# EAGLE design Painting (EAGLE 9.6.2)
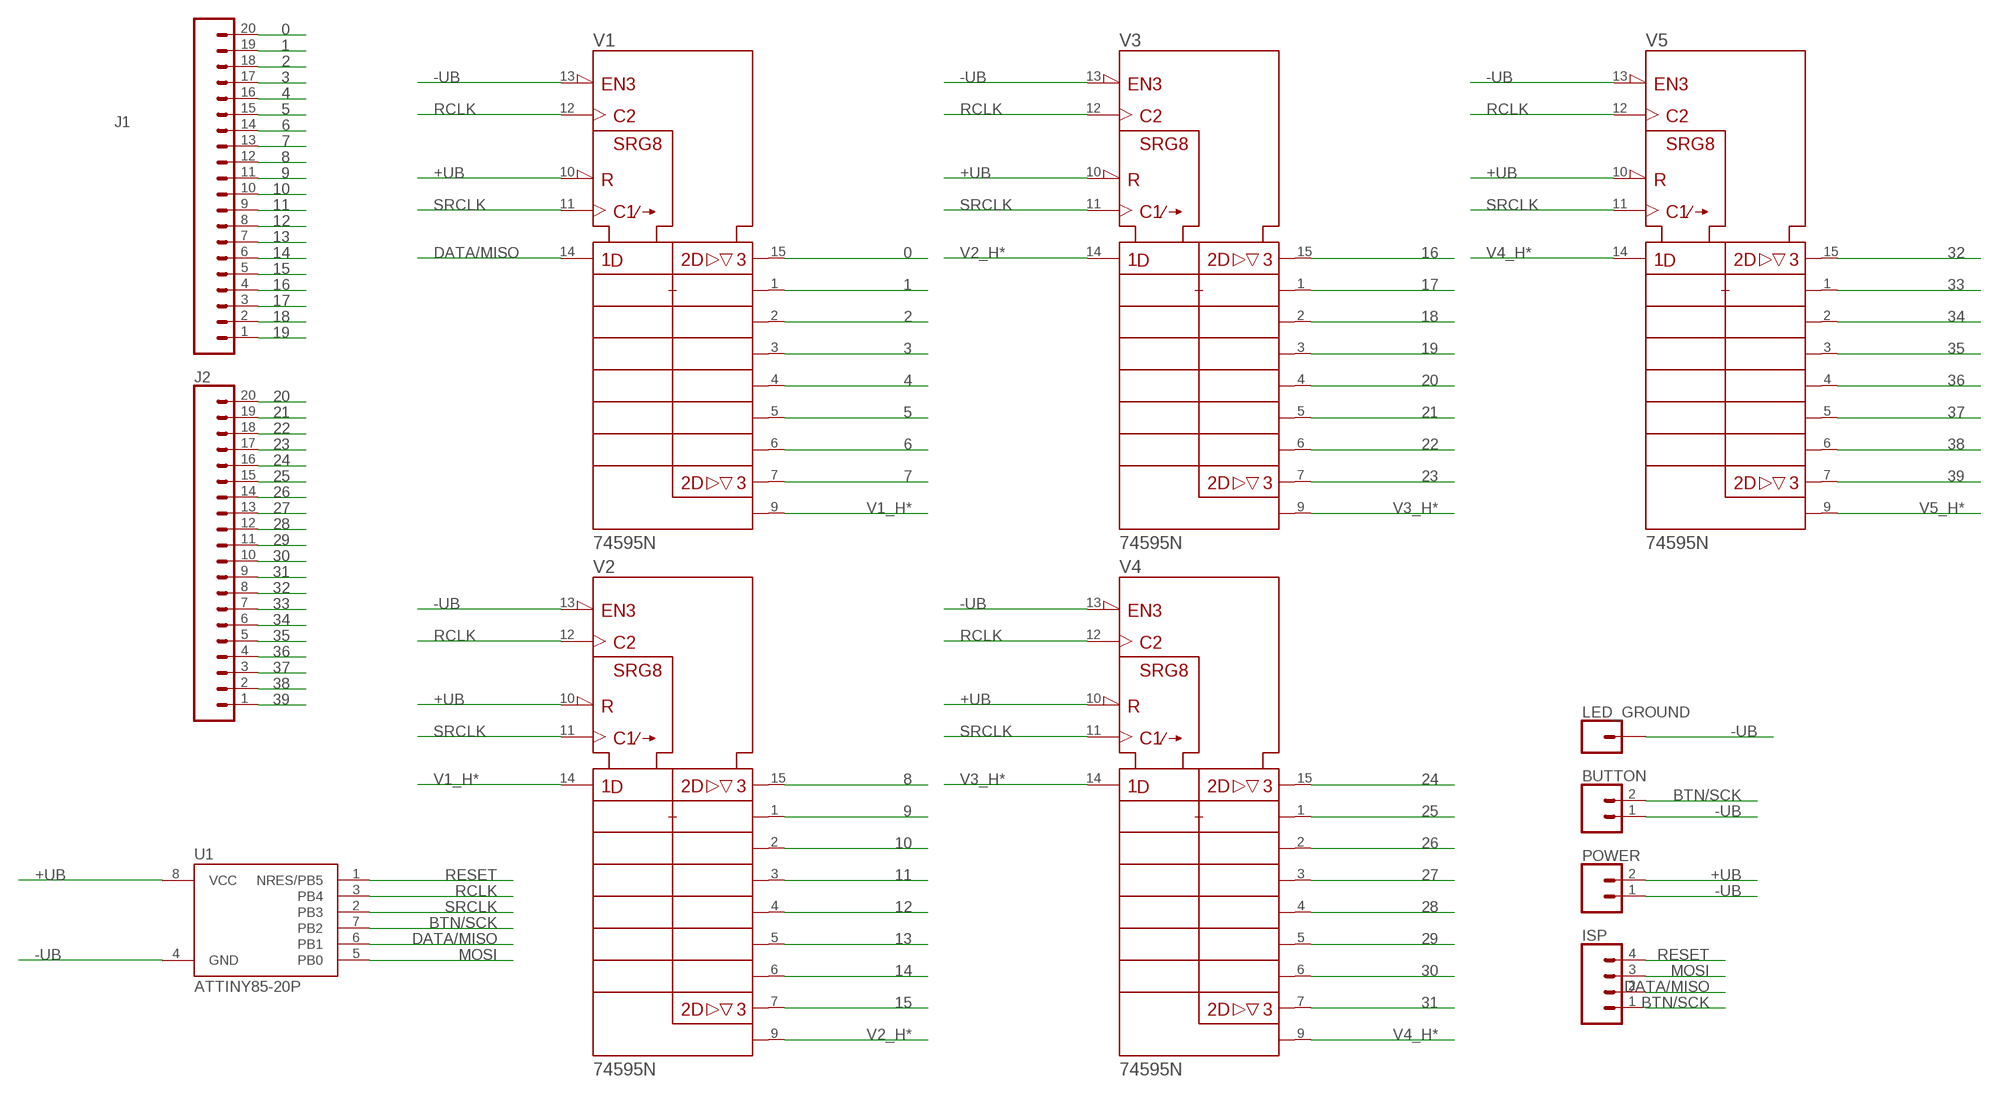
[diagram p0: schematic, sheet 1]

## Parts
BUTTON  CONN_02PTH3  [1X02_LONGPADS]
ISP  CONN_04LONGPADS  [1X04_LONGPADS]
J1  CONN_20  [1X20]
J2  CONN_20  [1X20]
LED_GROUND  CONN_01PTH_LONGPAD  [1X01_LONGPAD]
POWER  CONN_02PTH3  [1X02_LONGPADS]
U1  ATTINY85-20P  [PDIP08_300MIL]
V1  74595N  [DIL16]
V2  74595N  [DIL16]
V3  74595N  [DIL16]
V4  74595N  [DIL16]
V5  74595N  [DIL16]

## Nets
0: J1.20 V1.15(QA)
1: J1.19 V1.1(QB)
2: J1.18 V1.2(QC)
3: J1.17 V1.3(QD)
4: J1.16 V1.4(QE)
5: J1.15 V1.5(QF)
6: J1.14 V1.6(QG)
7: J1.13 V1.7(QH)
8: J1.12 V2.15(QA)
9: J1.11 V2.1(QB)
10: J1.10 V2.2(QC)
11: J1.9 V2.3(QD)
12: J1.8 V2.4(QE)
13: J1.7 V2.5(QF)
14: J1.6 V2.6(QG)
15: J1.5 V2.7(QH)
16: J1.4 V3.15(QA)
17: J1.3 V3.1(QB)
18: J1.2 V3.2(QC)
19: J1.1 V3.3(QD)
20: J2.20 V3.4(QE)
21: J2.19 V3.5(QF)
22: J2.18 V3.6(QG)
23: J2.17 V3.7(QH)
24: J2.16 V4.15(QA)
25: J2.15 V4.1(QB)
26: J2.14 V4.2(QC)
27: J2.13 V4.3(QD)
28: J2.12 V4.4(QE)
29: J2.11 V4.5(QF)
30: J2.10 V4.6(QG)
31: J2.9 V4.7(QH)
32: J2.8 V5.15(QA)
33: J2.7 V5.1(QB)
34: J2.6 V5.2(QC)
35: J2.5 V5.3(QD)
36: J2.4 V5.4(QE)
37: J2.3 V5.5(QF)
38: J2.2 V5.6(QG)
39: J2.1 V5.7(QH)
+UB: POWER.2 U1.8(VCC) V1.10(!SRCLR) V2.10(!SRCLR) V3.10(!SRCLR) V4.10(!SRCLR) V5.10(!SRCLR)
-UB: BUTTON.1 LED_GROUND.1 POWER.1 U1.4(GND) V1.13(!G) V2.13(!G) V3.13(!G) V4.13(!G) V5.13(!G)
BTN/SCK: BUTTON.2 ISP.1 U1.7(PB2)
DATA/MISO: ISP.2 U1.6(PB1) V1.14(SER)
MOSI: ISP.3 U1.5(PB0)
RCLK: U1.3(PB4) V1.12(RCK) V2.12(RCK) V3.12(RCK) V4.12(RCK) V5.12(RCK)
RESET: ISP.4 U1.1(NRES/PB5)
SRCLK: U1.2(PB3) V1.11(SRCK) V2.11(SRCK) V3.11(SRCK) V4.11(SRCK) V5.11(SRCK)
V1_H*: V1.9(QH*) V2.14(SER)
V2_H*: V2.9(QH*) V3.14(SER)
V3_H*: V3.9(QH*) V4.14(SER)
V4_H*: V4.9(QH*) V5.14(SER)
V5_H*: V5.9(QH*)

## Power pins joined to a net without a drawn wire
+UB: V1.16(+UB) V2.16(+UB) V3.16(+UB) V4.16(+UB) V5.16(+UB)
-UB: V1.8(-UB) V2.8(-UB) V3.8(-UB) V4.8(-UB) V5.8(-UB)

## Library data of the parts
BUTTON POWER = SparkFun-Connectors:CONN_02: Multi connection point. Often used as Generic Header-pin footprint for 0.1 inch spaced/style header connections On any of the 0.1 inch spaced packages, you can populate with these: Break Away Headers - Straight <https://www.sparkfun.com/products/116> (PRT-00116) Break Away Male Headers - Right Angle <https://www.sparkfun.com/products/553> (PRT-00553) Female Headers <https://www.sparkfun.com/products/115> (PRT-00115) Break Away Headers - Machine Pin <https://www.sparkfun.com/products/117> (PRT-00117) Break Away Female Headers - Swiss Machine Pin <https://www.sparkfun.com/products/743> (PRT-00743) For SCREWTERMINALS and SPRING TERMINALS visit here: Screw Terimnals on SparkFun.com <https://www.sparkfun.com/search/results?term=Screw+Terminals> (5mm/3.5mm/2.54mm spacing) This device is also useful as a general connection point to wire up your design to another part of your project. Our various solder wires solder well into these plated through hole pads. Hook-Up Wire - Assortment (Stranded, 22 AWG) <https://www.sparkfun.com/products/11375> (PRT-11375) Hook-Up Wire - Assortment (Solid Core, 22 AWG) <https://www.sparkfun.com/products/11367> (PRT-11367) View the entire wire category on our website here <https://www.sparkfun.com/categories/141> Special notes: Molex polarized connector foot print use with: PRT-08233 with associated crimp pins and housings. 2.54_SCREWTERM for use with PRT-10571. 3.5mm Screw Terminal footprints for PRT-08084 5mm Screw Terminal footprints for use with PRT-08432
ISP = SparkFun-Connectors:CONN_04: Multi connection point. Often used as Generic Header-pin footprint for 0.1 inch spaced/style header connections On any of the 0.1 inch spaced packages, you can populate with these: Break Away Headers - Straight <https://www.sparkfun.com/products/116> (PRT-00116) Break Away Male Headers - Right Angle <https://www.sparkfun.com/products/553> (PRT-00553) Female Headers <https://www.sparkfun.com/products/115> (PRT-00115) Break Away Headers - Machine Pin <https://www.sparkfun.com/products/117> (PRT-00117) Break Away Female Headers - Swiss Machine Pin <https://www.sparkfun.com/products/743> (PRT-00743) For SCREWTERMINALS and SPRING TERMINALS visit here: Screw Terimnals on SparkFun.com <https://www.sparkfun.com/search/results?term=Screw+Terminals> (5mm/3.5mm/2.54mm spacing) This device is also useful as a general connection point to wire up your design to another part of your project. Our various solder wires solder well into these plated through hole pads. Hook-Up Wire - Assortment (Stranded, 22 AWG) <https://www.sparkfun.com/products/11375> (PRT-11375) Hook-Up Wire - Assortment (Solid Core, 22 AWG) <https://www.sparkfun.com/products/11367> (PRT-11367) View the entire wire category on our website here <https://www.sparkfun.com/categories/141> Special notes: Molex polarized connector foot print use with SKU : PRT-08231 with associated crimp pins and housings. 1MM SMD Version SKU: PRT-10208; PROD_ID: CONN-09696
J1 J2 = SparkFun-Connectors:CONN_20: Multi connection point. Often used as Generic Header-pin footprint for 0.1 inch spaced/style header connections On any of the 0.1 inch spaced packages, you can populate with these: Break Away Headers - Straight <https://www.sparkfun.com/products/116> (PRT-00116) Break Away Male Headers - Right Angle <https://www.sparkfun.com/products/553> (PRT-00553) Female Headers <https://www.sparkfun.com/products/115> (PRT-00115) Break Away Headers - Machine Pin <https://www.sparkfun.com/products/117> (PRT-00117) Break Away Female Headers - Swiss Machine Pin <https://www.sparkfun.com/products/743> (PRT-00743) For SCREWTERMINALS and SPRING TERMINALS visit here: Screw Terimnals on SparkFun.com <https://www.sparkfun.com/search/results?term=Screw+Terminals> (5mm/3.5mm/2.54mm spacing) This device is also useful as a general connection point to wire up your design to another part of your project. Our various solder wires solder well into these plated through hole pads. Hook-Up Wire - Assortment (Stranded, 22 AWG) <https://www.sparkfun.com/products/11375> (PRT-11375) Hook-Up Wire - Assortment (Solid Core, 22 AWG) <https://www.sparkfun.com/products/11367> (PRT-11367) View the entire wire category on our website here <https://www.sparkfun.com/categories/141> Special notes: Molex polarized connector foot print use with SKU : PRT-08231 with associated crimp pins and housings. 1MM SMD Version SKU: PRT-10208 NOTES ON THE VARIANTS LOCK and LOCK_LONGPADS... This footprint was designed to help hold the alignment of a through-hole component (i.e. 6-pin header) while soldering it into place. You may notice that each hole has been shifted either up or down by 0.005 of an inch from it's more standard position (which is a perfectly straight line). This slight alteration caused the pins (the squares in the middle) to touch the edges of the holes. Because they are alternating, it causes a "brace" to hold the component in place. 0.005 has proven to be the perfect amount of "off-center" position when using our standard breakaway headers. Although looks a little odd when you look at the bare footprint, once you have a header in there, the alteration is very hard to notice. Also,if you push a header all the way into place, it is covered up entirely on the bottom side. Note about LOCK SPECIAL package: This is just like the LOCK variant in that the holes are staggared by 5 mil, but except for the last two holes. They are not altered from the "standard" footprint layout. This is used for a special purpose on the layout of our Graphic LCD Backpack. Make sure you want to use this device before selecting it for you project!
LED_GROUND = SparkFun-Connectors:CONN_01: Single connection point. Often used as Generic Header-pin footprint for 0.1 inch spaced/style header connections On any of the 0.1 inch spaced packages, you can populate with these: Break Away Headers - Straight <https://www.sparkfun.com/products/116> (PRT-00116) Break Away Male Headers - Right Angle <https://www.sparkfun.com/products/553> (PRT-00553) Female Headers <https://www.sparkfun.com/products/115> (PRT-00115) Break Away Headers - Machine Pin <https://www.sparkfun.com/products/117> (PRT-00117) Break Away Female Headers - Swiss Machine Pin <https://www.sparkfun.com/products/743> (PRT-00743) This device is also useful as a general connection point to wire up your design to another part of your project. Our various solder wires solder well into these plated through hole pads. Hook-Up Wire - Assortment (Stranded, 22 AWG) <https://www.sparkfun.com/products/11375> (PRT-11375) Hook-Up Wire - Assortment (Solid Core, 22 AWG) <https://www.sparkfun.com/products/11367> (PRT-11367) View the entire wire category on our website here <https://www.sparkfun.com/categories/141> Special notes: SMTSO-256-ET is a "flush mount" nut for a 4-40 screw. We mostly use this on specialty testbeds; it is a nice way to connect hardware to your PCB at an adjustable hieght. Also note, the SNAP packages are for using a snappable style connector. We sell a baggie of snaps and they are also used on two LilyPad designs: Snap Assortment - 30 pack (male and female) <https://www.sparkfun.com/products/11347> (DEV-11347) LilyPad Arduino SimpleSnap <https://www.sparkfun.com/products/10941> (DEV-10941) LilyPad SimpleSnap Protoboard <https://www.sparkfun.com/products/10940> (DEV-10940)
U1 = _hhn_attiny25_45_85:ATTINY85*: ATMEL ATtiny 85 Packages: P = PDIP 08 30mil S = SOIC 08 EIAJ 208mil Technologies Note: for complete ordering code (temp. range, finish, tape&reel etc.) see www.atmel.com • Supply Voltage: V = (1.8…5.5)V | [blank] = (2.7…5.5)V • Speed: 10 = 10 MHz | 20 = 20 MHz Author: Dipl.-Ing. FH Rainer Bayer HHN Hochschule Heilbronn (Heilbronn University), rainer.bayer@hs-heilbronn.de Ingenieurbüro ing-rb, mail@ing-rb.de
V1-V5 = 74ttl-din:74*595: 8-bit SHIFT REGISTER, output latch

## Board
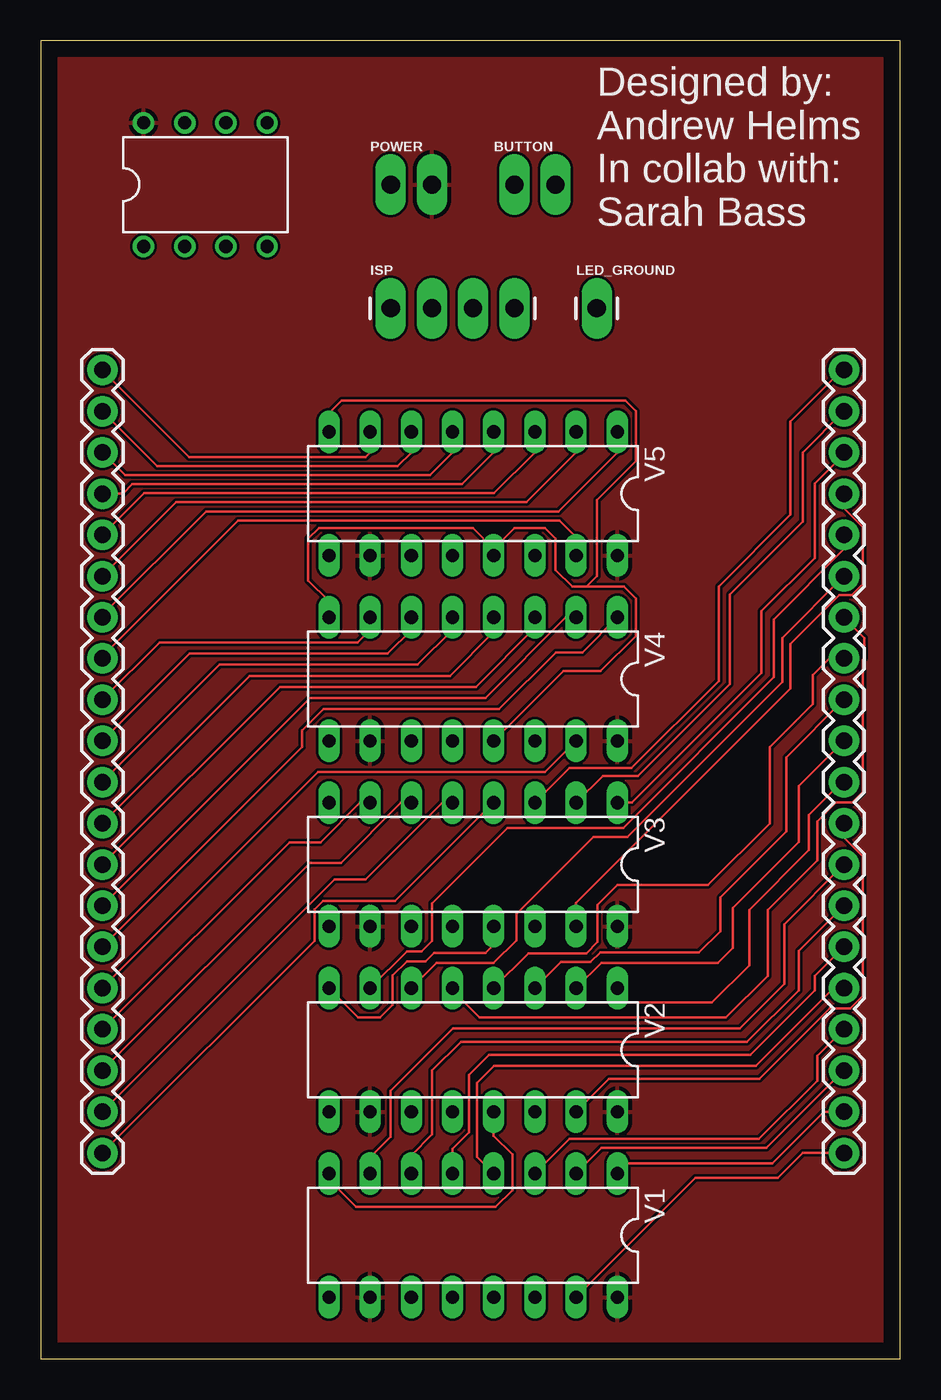
[diagram p1: board, top side]
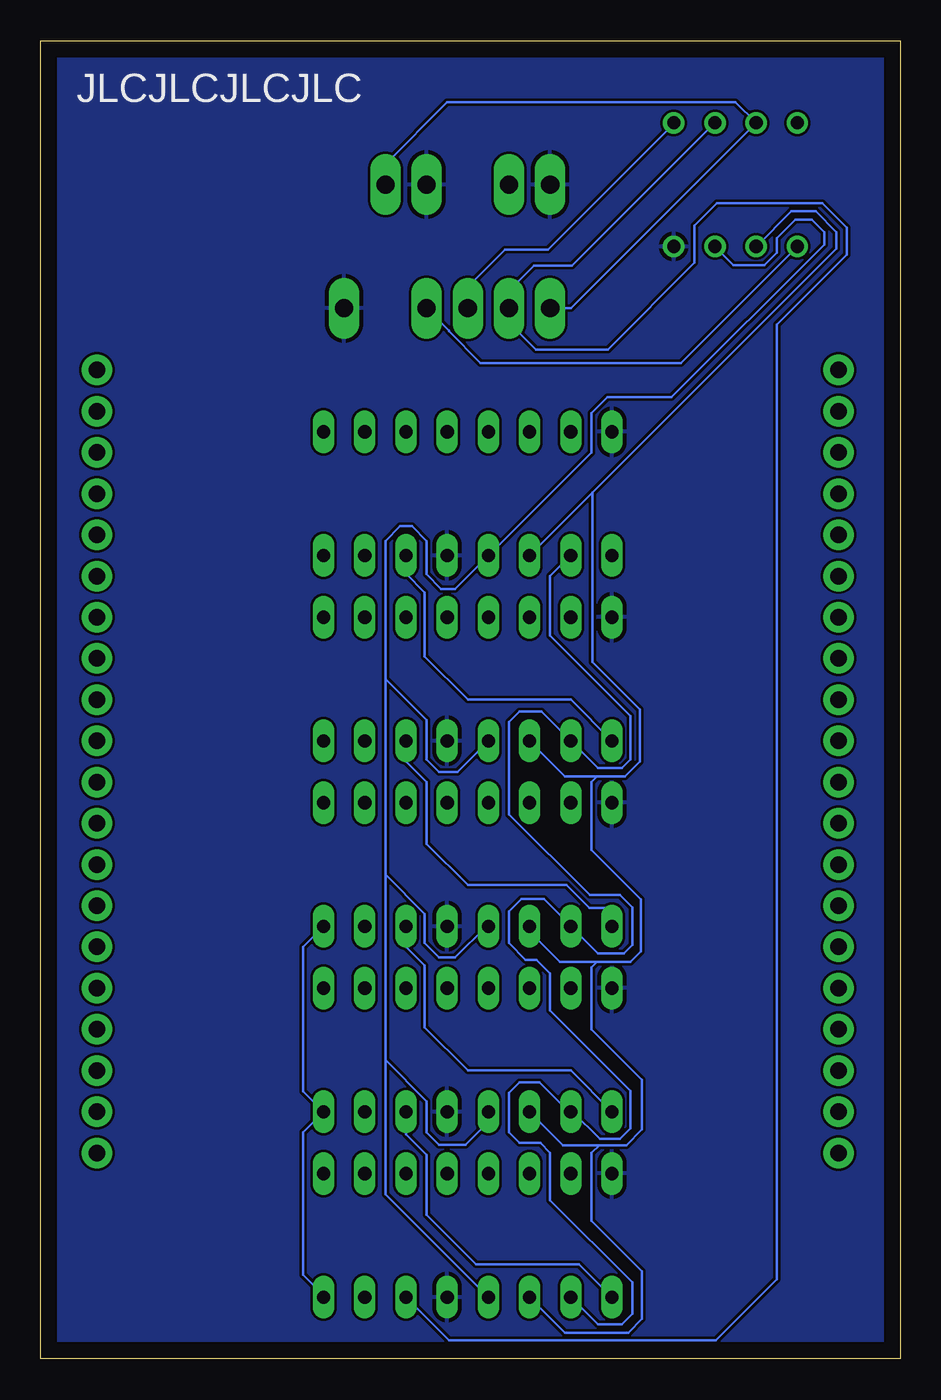
[diagram p2: board, bottom side, seen from below]

Size 53.01 x 81.27 mm. Coordinates in mm from the lower left corner, seen from the top.
Outline: 0,0 53.01,0 53.01,81.27 0,81.27 0,0
Copper layers (1*16): Top 0.035mm / dielectric 1.5mm / Bottom 0.035mm
Design rules "default": minimum track width 6mil, minimum drill 0.35mm, track to track 6mil, track to pad 6mil, pad to pad 6mil, via to via 6mil, smd to smd 6mil, copper to edge 40mil, drill to drill 6mil, minimum pad ring 10mil, minimum via ring 8mil, stop-mask expansion 4mil, vias tented up to drill 0mil, thermal gap 10mil

### Footprints (pad centres in the part's own frame; a part is rotated, then mirrored left to right if it is on the bottom)
1X02_LONGPADS = drill 1.118 pad 1.88 long: 1 0,0; 2 2.54,0
1X04_LONGPADS = drill 1.118 pad 1.88 long: 1 0,0; 2 2.54,0; 3 5.08,0; 4 7.62,0
1X20 = drill 1.016 pad 1.88: 1 0,0; 2 2.54,0; 3 5.08,0; 4 7.62,0; 5 10.16,0; 6 12.7,0; 7 15.24,0; 8 17.78,0; 9 20.32,0; 10 22.86,0; 11 25.4,0; 12 27.94,0; 13 30.48,0; 14 33.02,0; 15 35.56,0; 16 38.1,0; 17 40.64,0; 18 43.18,0; 19 45.72,0; 20 48.26,0
1X01_LONGPAD = drill 1.118 pad 1.88 long: 1 0,0
PDIP08_300MIL = drill 0.813: 1 -3.81,-3.81; 2 -1.27,-3.81; 3 1.27,-3.81; 4 3.81,-3.81; 5 3.81,3.81; 6 1.27,3.81; 7 -1.27,3.81; 8 -3.81,3.81
DIL16 = drill 0.813 long: 1 -8.89,-3.81; 2 -6.35,-3.81; 3 -3.81,-3.81; 4 -1.27,-3.81; 5 1.27,-3.81; 6 3.81,-3.81; 7 6.35,-3.81; 8 8.89,-3.81; 9 8.89,3.81; 10 6.35,3.81; 11 3.81,3.81; 12 1.27,3.81; 13 -1.27,3.81; 14 -3.81,3.81; 15 -6.35,3.81; 16 -8.89,3.81

### Placement (x,y rotation side)
BUTTON  29.21,72.39 0 top
ISP  21.59,64.77 0 top
J1  49.53,60.96 270 top
J2  3.81,60.96 270 top
LED_GROUND  34.29,64.77 0 top
POWER  21.59,72.39 0 top
U1  10.16,72.39 0 top
V1  26.67,7.62 180 top
V2  26.67,19.05 180 top
V3  26.67,30.48 180 top
V4  26.67,41.91 180 top
V5  26.67,53.34 180 top

### Tracks (layer width: path | path; a pad name or v marks a point on that pad's centre or on a via)
0
  Top 0.152: J1.20 46.99,12.7 45.47,11.18 40.39,11.18 V1.15
1
  Top 0.152: V1.1 36.2,12.06 45.11,12.06 48.28,15.24 J1.19
2
  Top 0.152: V1.2 34.59,13 44.76,13 J1.18
3
  Top 0.152: V1.3 32.61,13.56 44.3,13.56 47.88,17.14 47.88,18.67 J1.17
4
  Top 0.152: V1.4 26.92,12.45 26.92,17.03 27.95,18.06 44.09,18.06 48.9,22.86 J1.16
5
  Top 0.152: J1.15 47.75,23.62 47.75,22.73 43.76,18.75 27.64,18.75 26.42,17.53 26.42,13.96 25.4,12.94 V1.5
6
  Top 0.152: J1.14 46.74,25.15 46.74,22.73 43.56,19.56 25.91,19.56 24.13,17.78 24.13,13.83 22.86,12.56 V1.6
7
  Top 0.152: J1.13 45.85,26.8 45.85,23.11 43.1,20.37 25.44,20.37 21.59,16.52 21.59,13.7 20.32,12.43 V1.7
8
  Top 0.152: V2.15 35.05,17.27 44.32,17.27 48.67,21.61 49.94,21.61 50.7,22.38 50.7,30.96 49.53,32.13 J1.12
9
  Top 0.152: V2.1 35.56,22.22 35.81,21.97 41.4,21.97 43.69,24.26 43.69,27.69 47.37,31.37 47.37,33.53 49.4,35.56 J1.11
10
  Top 0.152: V2.2 34.57,24.41 41.76,24.41 42.67,25.32 42.67,27.81 46.74,31.88 46.74,35.31 J1.10
11
  Top 0.152: V2.3 32.08,24.46 33.91,24.46 34.51,25.06 40.6,25.06 41.91,26.36 41.91,28.45 45.97,32.51 45.97,37.08 J1.9
12
  Top 0.152: V2.4 30.07,24.99 33.64,24.99 34.35,25.7 34.35,27.98 35.57,29.21 41.15,29.21 44.96,33.02 44.96,37.72 47.62,40.39 47.62,42.16 48.64,43.18 J1.8
13
  Top 0.152: V2.5 25.4,22.72 27.06,21.06 42.27,21.06 44.83,23.62 44.83,27.69 47.88,30.73 47.88,33.15 49.02,34.29 50.04,34.29 50.7,34.95 50.7,43.08 50.8,43.18 50.8,44.45 J1.7
14
  Top 0.152: V2.6 24.41,24.41 27.94,24.41 29.34,25.81 29.34,27.45 34.07,32.18 36.18,32.18 45.72,41.72 45.72,44.45 J1.6
15
  Top 0.152: V2.7 22.58,25.12 23.48,25.12 24.13,25.77 24.13,28.08 28.79,32.74 35.93,32.74 45.21,42.02 45.21,45.59 49.53,49.91 J1.5
16
  Top 0.152: V3.15 33.02,28.12 46.23,41.33 46.23,44.07 49.25,47.09 50.01,47.09 50.7,47.78 50.7,51.28 49.53,52.45 J1.4
17
  Top 0.152: V3.1 36.46,34.29 44.45,42.28 44.45,46.1 47.73,49.38 47.73,53.95 49.53,55.75 J1.3
18
  Top 0.152: J1.2 46.99,55.88 46.99,51.61 42.49,47.12 42.49,41.61 36.83,35.94 34.67,35.94 V3.2
19
  Top 0.152: V3.3 32.61,36.42 36.44,36.42 41.81,41.8 41.81,47.62 46.23,52.04 46.23,57.79 49.4,60.96 J1.1
20
  Top 0.152: J2.20 16.89,25.78 16.89,27.7 17.41,28.22 21.87,28.22 V3.4
21
  Top 0.152: J2.19 18.14,29.57 20.05,29.57 24.78,34.29 V3.5
22
  Top 0.152: J2.18 16.61,30.58 18.53,30.58 22.24,34.29 V3.6
23
  Top 0.152: J2.17 15.34,31.85 17.26,31.85 19.7,34.29 V3.7
24
  Top 0.152: J2.16 17.12,36.17 31.09,36.17 V4.15
25
  Top 0.152: J2.15 16.13,37.72 16.13,38.75 17.44,40.06 28.26,40.06 31.76,43.56 33.4,43.56 V4.1
26
  Top 0.152: J2.14 16.61,40.74 27.42,40.74 32.4,45.72 V4.2
27
  Top 0.152: J2.13 14.76,41.43 26.84,41.43 30.48,45.07 V4.3
28
  Top 0.152: J2.12 12.9,42.11 25.23,42.11 27.94,44.82 V4.4
29
  Top 0.152: J2.11 11.05,42.8 23.25,42.8 25.4,44.95 V4.5
30
  Top 0.152: J2.10 9.2,43.49 21.4,43.49 22.86,44.95 V4.6
31
  Top 0.152: J2.9 7.34,44.17 19.53,44.17 20.32,44.96 V4.7
32
  Top 0.152: J2.8 3.81,43.31 12.19,51.69 32,51.69 33.02,50.67 V5.15
33
  Top 0.152: J2.7 3.81,45.85 10.21,52.25 31.94,52.25 35.56,55.87 V5.1
34
  Top 0.152: J2.6 8.36,52.81 29.96,52.81 33.02,55.87 V5.2
35
  Top 0.152: J2.5 6.38,53.37 27.96,53.37 30.48,55.88 V5.3
36
  Top 0.152: J2.4 5.08,53.34 5.66,53.92 25.98,53.92 27.94,55.88 V5.4
37
  Top 0.152: V5.5 25.4,55.88 24,54.48 5.21,54.48 J2.3
38
  Top 0.152: V5.6 22.86,55.88 22.02,55.04 7.19,55.04 J2.2
39
  Top 0.152: J2.1 9.17,55.6 20.04,55.6 20.32,55.88 V5.7
+UB
  Bottom 0.152: V1.10 20.32,3.8 18.66,2.13 17.16,2.13 16.51,2.78 16.51,4.71 21.59,9.79 21.59,12.71 22.19,13.31 23.48,13.31 24.13,13.96 24.13,16.4 23.48,17.04 22.24,17.04 20.43,15.24 V2.10 20.21,15.24 18.53,13.56 17.29,13.56 16.64,14.21 16.64,16.52 21.59,21.48 21.59,23.76 22.44,24.61 23.1,24.61 24.13,25.64 24.13,27.57 23.36,28.35 21.98,28.35 20.32,26.68 V3.10 18.64,24.99 17.03,24.99 16.51,25.51 16.51,27.83 17.29,28.6 19.15,28.6 24.13,33.58 24.13,39.26 23.48,39.9 22.12,39.9 V4.10 20.32,38.09 18.66,36.42 17.16,36.42 16.64,36.94 16.64,39.64 21.59,44.59 21.59,48.27 20.33,49.53 V5.10 | V1.16 35.56,3.92 36.83,5.19 36.83,13.98 35.57,15.24 | V2.16 35.57,15.24 | 35.57,15.24 36.83,16.5 36.83,25.4 V3.16
  pour Top: 0,81.28 0,0 53.34,0 53.34,81.28
-UB
  Top 0.152: V1.8 17.78,11.04 19.44,9.37 28.05,9.37 29.08,10.4 29.08,12.61 27.94,13.75 V2.13 | V2.8 17.78,22.85 19.57,21.06 20.94,21.06 21.72,21.83 21.72,23.63 22.59,24.51 23.75,24.51 24.26,25.02 27.43,25.02 27.94,25.53 V3.13 | 33.64,47.6 32.78,47.6 31.75,48.63 31.75,50.56 31.1,51.21 29.21,51.21 27.94,49.94 | 33.64,47.6 34.29,48.25 34.29,52.95 36.7,55.36 36.7,58.43 36.05,59.08 18.55,59.08 17.78,58.31 V5.8 | V4.8 17.78,46.72 16.51,47.99 16.51,50.56 17.16,51.21 26.67,51.21 27.94,49.94 | V4.13 32.23,42.39 34.53,42.39 36.7,44.56 36.7,46.88 35.98,47.6 33.64,47.6 | V5.13 27.94,49.94
  pour Bottom: 0,81.28 0,0 53.34,0 53.34,81.28
BTN/SCK
  Bottom 0.152: ISP.1 20.32,64.77 U1.7 10.16,77.47 27.94,77.47 31.75,73.66 BUTTON.2
DATA/MISO
  Bottom 0.152: U1.6 20.24,67.39 22.58,67.39 24.13,65.84 ISP.2 24.13,63.88 22.48,62.23 18.03,62.23 12.7,67.56 12.7,69.85 11.3,71.25 4.83,71.25 3.3,69.72 3.3,68.07 7.62,63.75 7.62,4.9 11.38,1.14 27.81,1.14 V1.14
MOSI
  Bottom 0.152: ISP.3 26.67,66.09 24.39,68.38 21.74,68.38 13.97,76.15 U1.5
RCLK
  Bottom 0.152: 31.75,41.92 31.75,50.43 30.85,51.33 30.11,51.33 29.21,50.43 29.21,48.37 28.31,47.47 27.46,47.47 V5.12 19.05,55.88 19.05,58.29 18.06,59.28 14.11,59.28 4.7,68.69 4.7,69.47 5.46,70.23 6.48,70.23 7.62,69.09 7.62,68.2 8.38,67.44 10.29,67.44 U1.3 | 31.75,29.86 31.75,18.43 | 31.75,18.43 31.75,10.16 V1.12 | V4.12 25.4,38.09 27.32,36.17 28.43,36.17 29.21,36.94 29.21,39.38 31.75,41.92 | V3.12 25.51,26.67 27.45,24.74 28.43,24.74 29.34,25.64 29.34,27.45 31.75,29.86 | V2.12 25.4,14.61 26.81,13.2 28.45,13.2 29.21,13.96 29.21,15.89 31.75,18.43 | 31.75,29.86 31.75,41.92
RESET
  Bottom 0.152: ISP.4 27.84,63.4 27.84,63.35 25.88,61.39 13.54,61.39 U1.1
SRCLK
  Bottom 0.152: 18.99,53.4 3.94,68.45 3.94,69.47 5.21,70.74 6.73,70.74 U1.2 | 18.99,53.4 V5.11 | 18.99,53.4 18.99,42.96 16.07,40.04 16.07,36.83 16.98,35.92 18.69,35.92 | V4.11 20.68,35.92 18.69,35.92 | 18.69,24.49 16.65,24.49 16,25.13 16,28.32 19.05,31.37 19.05,35.56 18.69,35.92 | 18.69,24.49 20.98,24.49 22.86,26.36 V3.11 | V2.11 20.8,13.18 18.57,13.18 | V1.11 20.68,1.63 16.78,1.63 15.94,2.46 15.94,5.4 19.05,8.51 19.05,12.7 18.57,13.18 | 18.69,24.49 19.05,24.13 19.05,20.32 15.94,17.21 15.94,14.15 16.9,13.18 18.57,13.18
V1_H*
  Bottom 0.152: V1.9 19.81,5.84 26.16,5.84 29.21,8.89 29.21,12.59 30.48,13.86 V2.14
V2_H*
  Bottom 0.152: V2.9 20.32,17.78 26.67,17.78 29.34,20.45 29.34,24.27 30.48,25.41 V3.14
V3_H*
  Bottom 0.152: V4.14 30.48,36.84 29.21,35.57 29.21,31.75 26.67,29.21 20.57,29.21 19.18,27.81 18.16,27.81 17.78,27.43 V3.9
V4_H*
  Bottom 0.152: V4.9 20.32,40.64 26.67,40.64 29.34,43.31 29.34,47.26 30.48,48.4 V5.14

### Text on the board
tPlace: Designed by: / Andrew Helms / In collab with: / Sarah Bass
bPlace: JLCJLCJLCJLC